# EAGLE schematic light sensor basic (EAGLE 9.6.2)
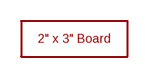
[diagram p0: schematic, sheet 1]

## Parts
U$1  2X3_BOARD_V2  [2X3_BOARD_V2]

## Library data of the parts
U$1 = voltera_community_lib:2X3_BOARD